# Altium project UPS_project.PrjPcb (part 3 of 4)
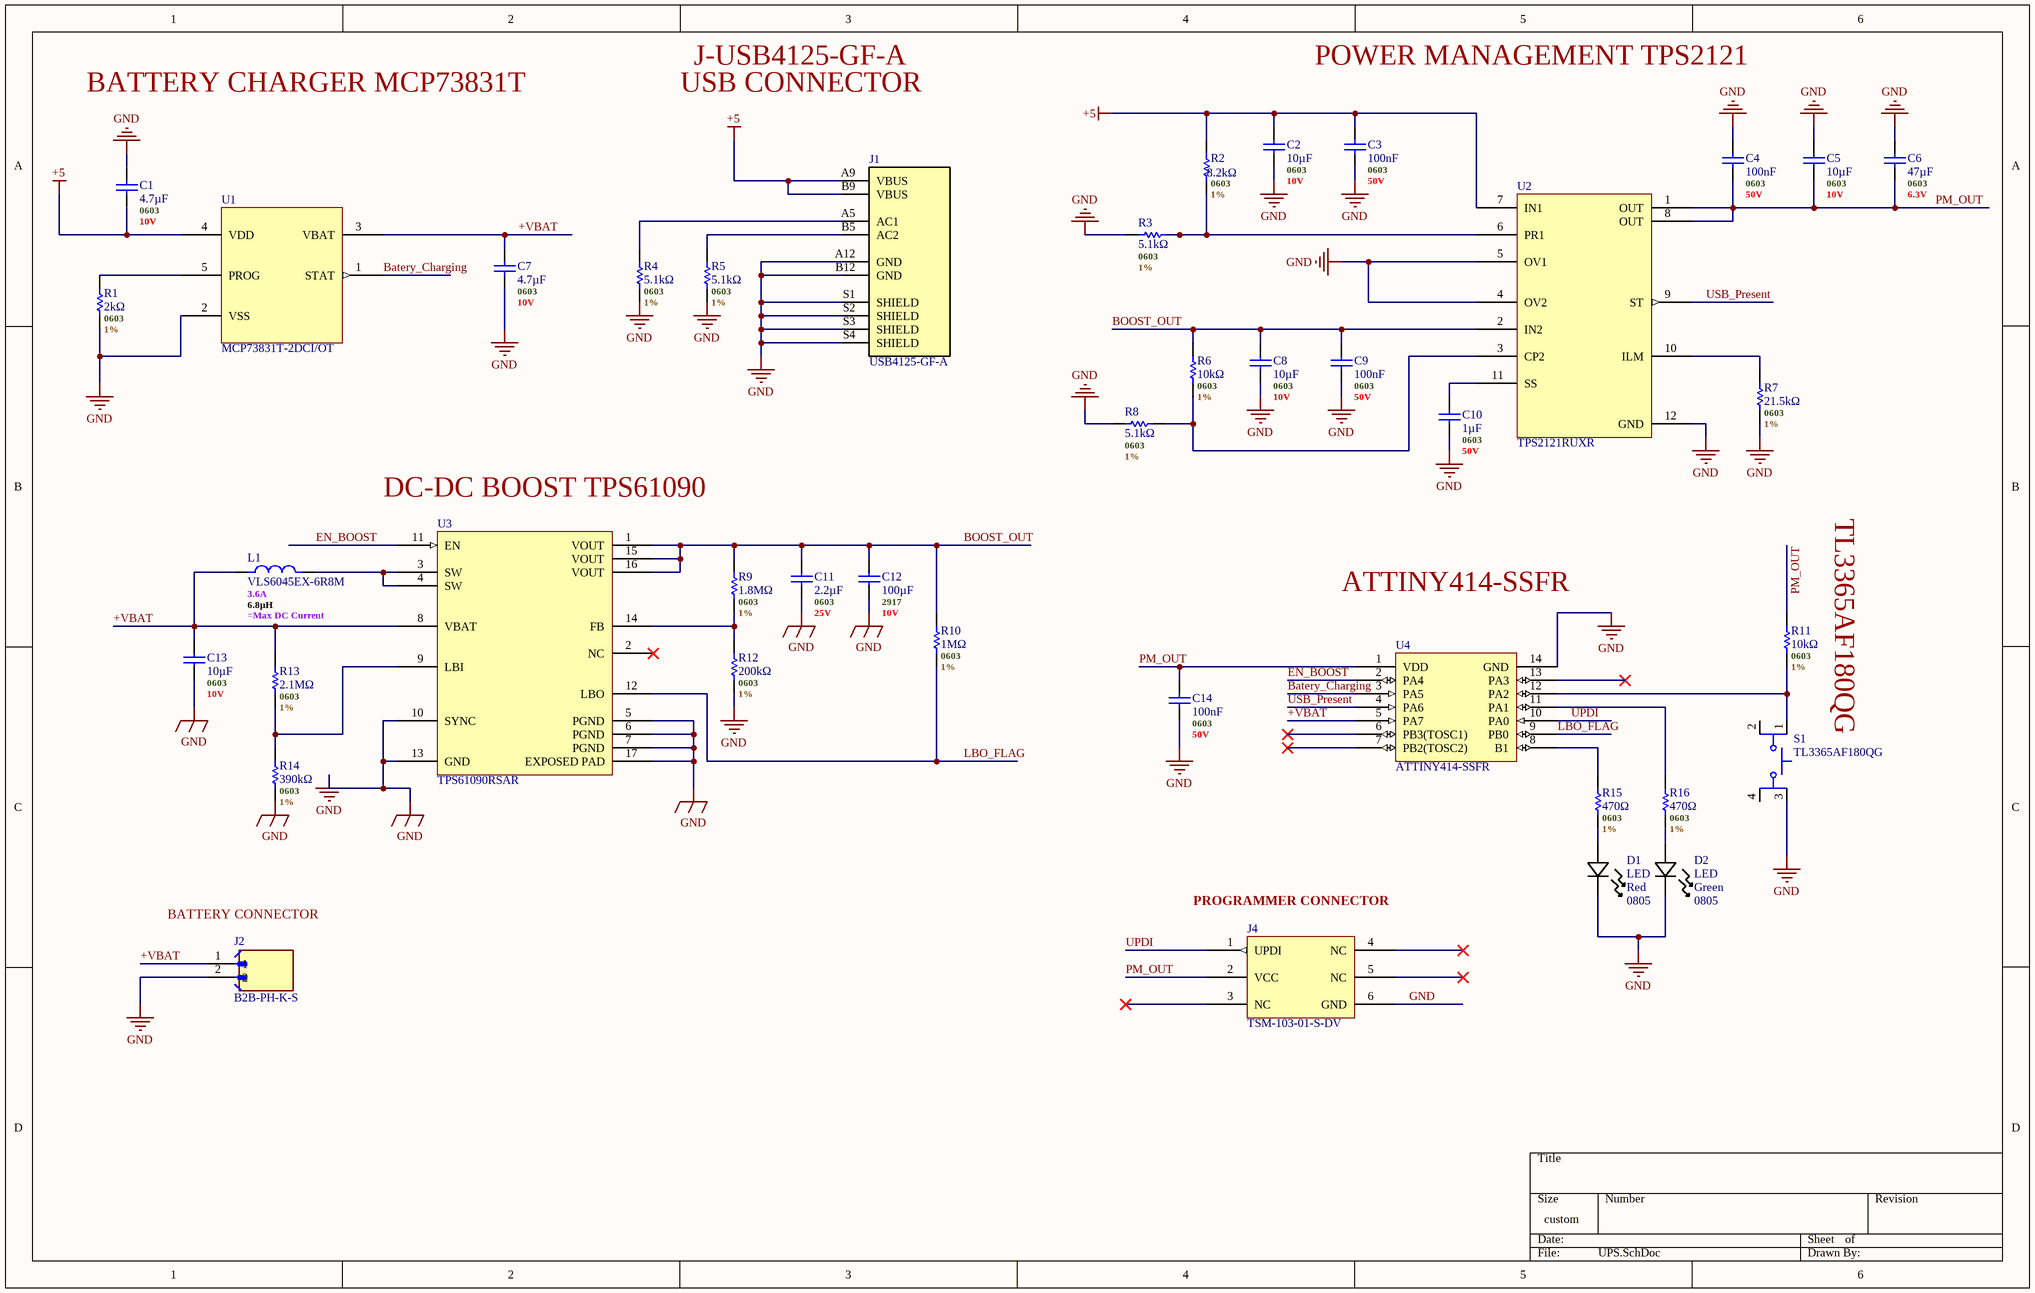
[diagram p2: UPS.SchDoc]

## Sheet UPS.SchDoc (continued)

### Library data of the parts (continued)
J4 = TSM-103-01-S-DV: Pin Header, Board-to-Board, 2.54 mm, 2 Rows, 6 Contacts, Surface Mount, TSM Series; Manufacturer: Samtec; Manufacturer Part Number: TSM-103-01-S-DV-P-TR; Manufacturer Lifecycle Status: PRODUCTION; Connector Type: Male Pin; Gender: Male; Max Current Rating: 7A; Max Voltage Rating (AC): 475V; Number of Contacts: 6; Pitch: 2.54mm; Supplier: DigiKey; Supplier Part Number: SAM13282TR-ND; RoHS: Compliant; Category: Headers and Wire Housings; Stock: 4800; Pricing: 150=1,1814, 750=0,8572, 1050=0,7779, 7500=0,6767, 15000=0,5197 (USD); Color: Black; Contact Material: Gold, Nickel; Contact Mating Length: 5.842mm; Contact Plating: Gold; Depth: 5.08mm; Height: 10.16mm; Housing Color: Black; Housing Material: Polymer; Lead Free: Lead Free; Length: 7.62mm; Lifecycle Status: Production; Max Operating Temperature: 125°C; Min Operating Temperature: -55°C; Mounting Technology: Surface Mount; Pins: 6; Number of Positions: 6; Number of Rows: 2; Packaging: Tape and Reel; Radiation Hardening: No; REACH SVHC: No; Row Spacing: 2.54mm; Termination: Solder; ComponentLink1URL: https://datasheet.octopart.com:443/TSM-103-01-S-DV-P-TR-Samtec-datasheet-151555687.pdf?src-supplier=Sager+Electronics; ComponentLink1Description: https://datasheet.octopart.com:443/TSM-103-01-S-DV-P-TR-Samtec-datasheet-151555687.pdf?src-supplier=Sager+Electronics; ComponentLink2URL: https://datasheet.octopart.com:443/TSM-103-01-S-DV-P-TR-Samtec-datasheet-97319594.pdf?src-supplier=Sager+Electronics; ComponentLink2Description: https://datasheet.octopart.com:443/TSM-103-01-S-DV-P-TR-Samtec-datasheet-97319594.pdf?src-supplier=Sager+Electronics; ComponentLink3URL: https://datasheet.octopart.com:443/TSM-103-01-S-DV-P-TR-Samtec-datasheet-155753699.pdf?src-supplier=Sager+Electronics; ComponentLink3Description: https://datasheet.octopart.com:443/TSM-103-01-S-DV-P-TR-Samtec-datasheet-155753699.pdf?src-supplier=Sager+Electronics; ComponentLink4URL: https://sigma.octopart.com:443/138897997/technical_drawing/Samtec-TSM-103-01-S-DV-P-TR.pdf?src-supplier=Upverter; ComponentLink4Description: https://sigma.octopart.com:443/138897997/technical_drawing/Samtec-TSM-103-01-S-DV-P-TR.pdf?src-supplier=Upverter; ComponentLink5URL: https://sigma.octopart.com:443/97319595/technical_drawing/Samtec-TSM-103-01-S-DV-P-TR.pdf?src-supplier=Samtec; ComponentLink5Description: https://sigma.octopart.com:443/97319595/technical_drawing/Samtec-TSM-103-01-S-DV-P-TR.pdf?src-supplier=Samtec; ComponentLink6URL: https://datasheet.octopart.com:443/TSM-103-01-S-DV-P-TR-Samtec-datasheet-68527555.pdf?src-supplier=Farnell; ComponentLink6Description: https://datasheet.octopart.com:443/TSM-103-01-S-DV-P-TR-Samtec-datasheet-68527555.pdf?src-supplier=Farnell; ComponentLink7URL: https://datasheet.octopart.com:443/TSM-103-01-S-DV-P-TR-Samtec-datasheet-141160580.pdf?src-supplier=Master+Electronics; ComponentLink7Description: https://datasheet.octopart.com:443/TSM-103-01-S-DV-P-TR-Samtec-datasheet-141160580.pdf?src-supplier=Master+Electronics; ComponentLink8URL: https://datasheet.octopart.com:443/TSM-103-01-S-DV-P-TR-Samtec-datasheet-41643181.pdf?src-supplier=Newark; ComponentLink8Description: https://datasheet.octopart.com:443/TSM-103-01-S-DV-P-TR-Samtec-datasheet-41643181.pdf?src-supplier=Newark; ComponentLink9URL: https://datasheet.octopart.com:443/TSM-103-01-S-DV-P-TR-Samtec-datasheet-24969259.pdf?src-supplier=Newark; ComponentLink9Description: https://datasheet.octopart.com:443/TSM-103-01-S-DV-P-TR-Samtec-datasheet-24969259.pdf?src-supplier=Newark; ComponentLink10URL: https://datasheet.octopart.com:443/TSM-103-01-S-DV-P-TR-Samtec-datasheet-180257387.pdf?src-supplier=JRH+Electronics; ComponentLink10Description: https://datasheet.octopart.com:443/TSM-103-01-S-DV-P-TR-Samtec-datasheet-180257387.pdf?src-supplier=JRH+Electronics; ComponentLink11URL: https://datasheet.octopart.com:443/TSM-103-01-S-DV-P-TR-Samtec-datasheet-116533474.pdf?src-supplier=Toby+Electronics; ComponentLink11Description: https://datasheet.octopart.com:443/TSM-103-01-S-DV-P-TR-Samtec-datasheet-116533474.pdf?src-supplier=Toby+Electronics; Supplier 1: DigiKey; Supplier Part Number 1: SAM13282CT-ND
L1 = INDUCTOR - GENERIC: Inductor Power Shielded Wirewound 6.8uH 20% 100KHz Ferrite 3.6A 0.0468Ohm DCR 2424 T/R; Manufacturer: TDK; Manufacturer Lifecycle Status: PRODUCTION; Current Rating: 4.7A; DC Resistance (DCR): 47mΩ; Value: 6.8µH; Number of Circuits: 1; Shielding: Yes; .Max DC Current: =Max DC Current; Supplier: DigiKey; Supplier Part Number: 445-173057-1-ND; Manufacturer Part Number: VLS6045EX-6R8M; RoHS: Compliant; Category: Fixed Inductors; Stock: 199761; Pricing: 1=0,34, 10=0,284, 100=0,2333 (USD); Case/Package: 2424; Composition: Wirewound; Core Material: Ferrite; Height: 4.5mm; Height - Seated (Max): 4.4958mm; Inductance Tolerance: 20%; Length: 6mm; Lifecycle Status: Production; Max Current Rating: 3.6A; Max Length: 6.3mm; Max Operating Temperature: 105°C; Max Width: 6.3mm; Min Length: 5.7mm; Min Operating Temperature: -40°C; Min Width: 5.7mm; Mounting Technology: Surface Mount; Number of Terminals: 2; REACH SVHC: Yes; RMS Current (Irms): 3.6A; Saturation Current: 4.7A; Schedule B: 8504500000, 8504500000|8504500000, 8504500000|8504500000|8504500000, 8504500000|8504500000|8504500000|8504500000; Test Frequency: 100kHz; Tolerance: 20%; Width: 6mm; ComponentLink1URL: https://datasheet.octopart.com:443/VLS6045EX-6R8M-TDK-datasheet-181269184.pdf?src-supplier=IHS; ComponentLink1Description: https://datasheet.octopart.com:443/VLS6045EX-6R8M-TDK-datasheet-181269184.pdf?src-supplier=IHS; ComponentLink2URL: https://datasheet.octopart.com:443/VLS6045EX-6R8M-TDK-datasheet-153842173.pdf?src-supplier=ODG+(Origin+Data+Global); ComponentLink2Description: https://datasheet.octopart.com:443/VLS6045EX-6R8M-TDK-datasheet-153842173.pdf?src-supplier=ODG+(Origin+Data+Global); ComponentLink3URL: https://datasheet.octopart.com:443/VLS6045EX-6R8M-TDK-datasheet-82987839.pdf?src-supplier=Newark; ComponentLink3Description: https://datasheet.octopart.com:443/VLS6045EX-6R8M-TDK-datasheet-82987839.pdf?src-supplier=Newark; ComponentLink4URL: https://datasheet.octopart.com:443/VLS6045EX-6R8M-TDK-datasheet-41475571.pdf?src-supplier=Newark; ComponentLink4Description: https://datasheet.octopart.com:443/VLS6045EX-6R8M-TDK-datasheet-41475571.pdf?src-supplier=Newark; ComponentLink5URL: https://datasheet.octopart.com:443/VLS6045EX-6R8M-TDK-datasheet-60278255.pdf?src-supplier=Future+Electronics; ComponentLink5Description: https://datasheet.octopart.com:443/VLS6045EX-6R8M-TDK-datasheet-60278255.pdf?src-supplier=Future+Electronics; Supplier 1: DigiKey; Supplier Part Number 1: 445-173057-1-ND
R1 = RESISTOR - GENERIC: Res Thick Film 0603 2K Ohm 1% 0.1W(1/10W) ±100ppm/C Epoxy Pad SMD Automotive T/R; Manufacturer: Yageo Group; Manufacturer Part Number: AC0603FR-102KL; Power Dissipation: 100mW; Temperature Coefficient: 100ppm/°C; Voltage Rating: 75V; Supplier: DigiKey; Supplier Part Number: 13-AC0603FR-102KLCT-ND; RoHS: Compliant; Category: Chip SMD Resistors; Stock: 20182; Pricing: 1=0,1, 10=0,007, 25=0,006, 50=0,0052, 100=0,005 (USD); Case/Package: 0603; China RoHS: Non-Compliant; Composition: Thick Film; Height: 450µm; Lifecycle Status: Production; Max Operating Temperature: 155°C; Min Operating Temperature: -55°C; Mounting Technology: Surface Mount; Number of Terminals: 2; Packaging: Tape & Reel; Power Rating: 100mW; REACH SVHC: Yes; Value: 2kΩ; Tolerance: 1%; Width: 800µm; Working Voltage: 75V; ComponentLink1URL: https://datasheet.octopart.com:443/AC0603FR-102KL-Yageo-datasheet-182189377.pdf?src-supplier=IHS; ComponentLink1Description: https://datasheet.octopart.com:443/AC0603FR-102KL-Yageo-datasheet-182189377.pdf?src-supplier=IHS; ComponentLink2URL: https://datasheet.octopart.com:443/AC0603FR-102KL-Yageo-datasheet-151884373.pdf?src-supplier=Upverter; ComponentLink2Description: https://datasheet.octopart.com:443/AC0603FR-102KL-Yageo-datasheet-151884373.pdf?src-supplier=Upverter; ComponentLink3URL: https://sigma.octopart.com:443/138820526/technical_drawing/Yageo-AC0603FR-102KL.pdf?src-supplier=Upverter; ComponentLink3Description: https://sigma.octopart.com:443/138820526/technical_drawing/Yageo-AC0603FR-102KL.pdf?src-supplier=Upverter; ComponentLink4URL: https://datasheet.octopart.com:443/AC0603FR-102KL-Yageo-datasheet-86786639.pdf?src-supplier=Upverter; ComponentLink4Description: https://datasheet.octopart.com:443/AC0603FR-102KL-Yageo-datasheet-86786639.pdf?src-supplier=Upverter; ComponentLink5URL: https://datasheet.octopart.com:443/AC0603FR-102KL-Yageo-datasheet-178509465.pdf?src-supplier=Farnell; ComponentLink5Description: https://datasheet.octopart.com:443/AC0603FR-102KL-Yageo-datasheet-178509465.pdf?src-supplier=Farnell; ComponentLink6URL: https://datasheet.octopart.com:443/AC0603FR-102KL-Yageo-datasheet-166720450.pdf?src-supplier=JRH+Electronics; ComponentLink6Description: https://datasheet.octopart.com:443/AC0603FR-102KL-Yageo-datasheet-166720450.pdf?src-supplier=JRH+Electronics; ComponentLink7URL: https://datasheet.octopart.com:443/AC0603FR-102KL-Yageo-datasheet-137699919.pdf?src-supplier=Future+Electronics; ComponentLink7Description: https://datasheet.octopart.com:443/AC0603FR-102KL-Yageo-datasheet-137699919.pdf?src-supplier=Future+Electronics; ComponentLink8URL: https://datasheet.octopart.com/AC0603FR-102KL-Yageo-datasheet-12512238.pdf; ComponentLink8Description: https://datasheet.octopart.com/AC0603FR-102KL-Yageo-datasheet-12512238.pdf; ComponentLink9URL: http://sigma.octopart.com:80/rohs_statement/Yageo-company-2.pdf?src-supplier=Compliance+Statements; ComponentLink9Description: http://sigma.octopart.com:80/rohs_statement/Yageo-company-2.pdf?src-supplier=Compliance+Statements; ComponentLink10URL: http://sigma.octopart.com:80/conflict_mineral_statement/Yageo-company-3.pdf?src-supplier=Compliance+Statements; ComponentLink10Description: http://sigma.octopart.com:80/conflict_mineral_statement/Yageo-company-3.pdf?src-supplier=Compliance+Statements; Supplier 1: DigiKey; Supplier Part Number 1: 13-AC0603FR-102KLCT-ND
R2 = RESISTOR - GENERIC: Res Thick Film 0603 8.2K Ohm 1% 0.1W(1/10W) ±100ppm/C Pad SMD T/R; Manufacturer: Yageo Group; Manufacturer Part Number: RC0603FR-138K2L; Power Dissipation: 100mW; Temperature Coefficient: 100ppm/°C; Voltage Rating: 50V; Working Voltage: 75V; Supplier: DigiKey; Supplier Part Number: 13-RC0603FR-138K2LCT-ND; RoHS: Compliant; Category: Chip SMD Resistors; Stock: 30843; Pricing: 1=0,1, 10=0,008, 25=0,0072, 50=0,0062, 100=0,0051, 250=0,004 (USD); Case/Package: 0603; Case Code (Imperial): 0603; Case Code (Metric): 1608; China RoHS: Non-Compliant; Composition: Thick Film; Depth: 800µm; Height: 450µm; Length: 1.6mm; Lifecycle Status: Production; Max Operating Temperature: 155°C; Military Standard: Not; Min Operating Temperature: -55°C; Mounting Technology: Surface Mount; Number of Terminals: 2; Power Rating: 100mW; REACH SVHC: Yes; Value: 8.2kΩ; Schedule B: 8533210045, 8533210045|8533210045, 8533210045|8533210045|8533210045, 8533210045|8533210045|8533210045|8533210045; Termination: SMD/SMT; Tolerance: 1%; Width: 800µm; ComponentLink1URL: https://datasheet.octopart.com:443/RC0603FR-138K2L-Yageo-datasheet-175887523.pdf?src-supplier=Newark; ComponentLink1Description: https://datasheet.octopart.com:443/RC0603FR-138K2L-Yageo-datasheet-175887523.pdf?src-supplier=Newark; ComponentLink2URL: https://datasheet.octopart.com:443/RC0603FR-138K2L-Yageo-datasheet-164759695.pdf?src-supplier=Future+Electronics; ComponentLink2Description: https://datasheet.octopart.com:443/RC0603FR-138K2L-Yageo-datasheet-164759695.pdf?src-supplier=Future+Electronics; ComponentLink3URL: https://datasheet.octopart.com/RC0603FR-138K2L-Yageo-datasheet-73766026.pdf; ComponentLink3Description: https://datasheet.octopart.com/RC0603FR-138K2L-Yageo-datasheet-73766026.pdf; ComponentLink4URL: http://sigma.octopart.com:80/rohs_statement/Yageo-company-2.pdf?src-supplier=Compliance+Statements; ComponentLink4Description: http://sigma.octopart.com:80/rohs_statement/Yageo-company-2.pdf?src-supplier=Compliance+Statements; ComponentLink5URL: http://sigma.octopart.com:80/conflict_mineral_statement/Yageo-company-3.pdf?src-supplier=Compliance+Statements; ComponentLink5Description: http://sigma.octopart.com:80/conflict_mineral_statement/Yageo-company-3.pdf?src-supplier=Compliance+Statements; Supplier 1: DigiKey; Supplier Part Number 1: 13-RC0603FR-138K2LCT-ND
R3-R5 R8 = RESISTOR - GENERIC: Res Thick Film 0603 5.1K Ohm 1% 0.1W(1/10W) ±100ppm/C Pad SMD T/R; Manufacturer: Yageo Group; Manufacturer Part Number: RC0603FR-075K1L; Max Power Dissipation: 100mW; Temperature Coefficient: 100ppm/°C; Voltage Rating: 75V; Voltage Rating (DC): 50V; Supplier: DigiKey; Supplier Part Number: 311-5.10KHRCT-ND; RoHS: Compliant; Category: Chip SMD Resistors; Stock: 734211; Pricing: 1=0,1, 10=0,007, 25=0,0068, 50=0,0062, 100=0,0056 (USD); Case/Package: 0603; Case Code (Imperial): 0603; China RoHS: Non-Compliant; Composition: Thick Film; Depth: 800µm; Features: Moisture Resistant; Height: 450µm; Lead Free: Lead Free; Lifecycle Status: Production; Max Operating Temperature: 155°C; Military Standard: Not; Min Operating Temperature: -55°C; Mounting Technology: Surface Mount; Pins: 2; Number of Terminals: 2; Number of Terminations: 2; Packaging: Tape & Reel; Power Dissipation: 100mW; Power Rating: 100mW; REACH SVHC: Yes; Value: 5.1kΩ; Schedule B: 8533210045, 8533210045|8533210045, 8533210045|8533210045|8533210045, 8533210045|8533210045|8533210045|8533210045; Termination: SMD/SMT; Tolerance: 1%; Width: 800µm; Working Voltage: 75V; ComponentLink1URL: https://datasheet.octopart.com:443/RC0603FR-075K1L-Yageo-datasheet-175887523.pdf?src-supplier=IHS; ComponentLink1Description: https://datasheet.octopart.com:443/RC0603FR-075K1L-Yageo-datasheet-175887523.pdf?src-supplier=IHS; ComponentLink2URL: https://datasheet.octopart.com:443/RC0603FR-075K1L-Yageo-datasheet-103092701.pdf?src-supplier=Upverter; ComponentLink2Description: https://datasheet.octopart.com:443/RC0603FR-075K1L-Yageo-datasheet-103092701.pdf?src-supplier=Upverter; ComponentLink3URL: https://datasheet.octopart.com:443/RC0603FR-075K1L-Yageo-datasheet-8328172.pdf?src-supplier=Farnell; ComponentLink3Description: https://datasheet.octopart.com:443/RC0603FR-075K1L-Yageo-datasheet-8328172.pdf?src-supplier=Farnell; ComponentLink4URL: https://datasheet.octopart.com:443/RC0603FR-075K1L-Yageo-datasheet-62067350.pdf?src-supplier=Farnell; ComponentLink4Description: https://datasheet.octopart.com:443/RC0603FR-075K1L-Yageo-datasheet-62067350.pdf?src-supplier=Farnell; ComponentLink5URL: https://datasheet.octopart.com:443/RC0603FR-075K1L-Yageo-datasheet-34211833.pdf?src-supplier=element14+APAC; ComponentLink5Description: https://datasheet.octopart.com:443/RC0603FR-075K1L-Yageo-datasheet-34211833.pdf?src-supplier=element14+APAC; ComponentLink6URL: https://datasheet.octopart.com:443/RC0603FR-075K1L-Yageo-datasheet-164759695.pdf?src-supplier=Future+Electronics; ComponentLink6Description: https://datasheet.octopart.com:443/RC0603FR-075K1L-Yageo-datasheet-164759695.pdf?src-supplier=Future+Electronics; ComponentLink7URL: https://datasheet.octopart.com:443/RC0603FR-075K1L-Yageo-datasheet-137700087.pdf?src-supplier=Future+Electronics; ComponentLink7Description: https://datasheet.octopart.com:443/RC0603FR-075K1L-Yageo-datasheet-137700087.pdf?src-supplier=Future+Electronics; ComponentLink8URL: https://datasheet.octopart.com:443/RC0603FR-075K1L-Yageo-datasheet-15599030.pdf?src-supplier=Future+Electronics; ComponentLink8Description: https://datasheet.octopart.com:443/RC0603FR-075K1L-Yageo-datasheet-15599030.pdf?src-supplier=Future+Electronics; ComponentLink9URL: https://datasheet.octopart.com:443/RC0603FR-075K1L-Yageo-datasheet-12596169.pdf?src-supplier=Future+Electronics; ComponentLink9Description: https://datasheet.octopart.com:443/RC0603FR-075K1L-Yageo-datasheet-12596169.pdf?src-supplier=Future+Electronics; ComponentLink10URL: https://datasheet.octopart.com:443/RC0603FR-075K1L-Yageo-datasheet-503470.pdf?src-supplier=Future+Electronics; ComponentLink10Description: https://datasheet.octopart.com:443/RC0603FR-075K1L-Yageo-datasheet-503470.pdf?src-supplier=Future+Electronics; ComponentLink11URL: https://datasheet.octopart.com:443/RC0603FR-075K1L-Yageo-datasheet-148775077.pdf?src-supplier=TME; ComponentLink11Description: https://datasheet.octopart.com:443/RC0603FR-075K1L-Yageo-datasheet-148775077.pdf?src-supplier=TME; ComponentLink12URL: https://datasheet.octopart.com:443/RC0603FR-075K1L-Yageo-datasheet-79472498.pdf?src-supplier=Megastar; ComponentLink12Description: https://datasheet.octopart.com:443/RC0603FR-075K1L-Yageo-datasheet-79472498.pdf?src-supplier=Megastar; ComponentLink13URL: https://datasheet.octopart.com/RC0603FR-075K1L-Yageo-datasheet-73766026.pdf; ComponentLink13Description: https://datasheet.octopart.com/RC0603FR-075K1L-Yageo-datasheet-73766026.pdf; ComponentLink14URL: https://datasheet.octopart.com:443/RC0603FR-075K1L-Yageo-datasheet-118562.pdf?src-supplier=DigiKey; ComponentLink14Description: https://datasheet.octopart.com:443/RC0603FR-075K1L-Yageo-datasheet-118562.pdf?src-supplier=DigiKey; ComponentLink15URL: http://sigma.octopart.com:80/conflict_mineral_statement/Yageo-company-3.pdf?src-supplier=Compliance+Statements; ComponentLink15Description: http://sigma.octopart.com:80/conflict_mineral_statement/Yageo-company-3.pdf?src-supplier=Compliance+Statements; ComponentLink16URL: http://sigma.octopart.com:80/rohs_statement/Yageo-company-2.pdf?src-supplier=Compliance+Statements; ComponentLink16Description: http://sigma.octopart.com:80/rohs_statement/Yageo-company-2.pdf?src-supplier=Compliance+Statements; Supplier 1: DigiKey; Supplier Part Number 1: 311-5.10KHRCT-ND
R6 R11 = RESISTOR - GENERIC: 100mW Thick Film Resistors ±100ppm/℃ ±1% 10kΩ 0603 Chip Resistor - Surface Mount ROHS; Manufacturer: Yageo Group; Manufacturer Part Number: RC0603FR-0710KL; Temperature Coefficient: 100ppm/°C; Voltage Rating: 75V; Voltage Rating (DC): 50V; Supplier: DigiKey; Supplier Part Number: 311-10.0KHRCT-ND; RoHS: Compliant; Category: Chip SMD Resistors; Stock: 13219476; Pricing: 1=0,1, 10=0,006, 25=0,0052 (USD); Case/Package: 0603; Case Code (Imperial): 0603; Case Code (Metric): 0603; China RoHS: Non-Compliant; Composition: Thick Film; Depth: 800µm; Height: 450µm; Lead Free: Lead Free; Lead Pitch: 300µm; Length: 1.6mm; Lifecycle Status: Production; Max Operating Temperature: 155°C; Military Standard: Not; Min Operating Temperature: -55°C; Mounting Technology: Surface Mount; Pins: 2; Number of Terminals: 2; Packaging: Tape & Reel; Power Dissipation: 100mW; Power Rating: 100mW; REACH SVHC: Yes; Value: 10kΩ; Schedule B: 8533210045, 8533210045|8533210045|8533210045|8533210045|8533210045|8533210045|8533210045|8533210045|8533210045|8533210045|8533210045|8533210045|8533210045|8533210045|8533210045|8533210045|8533210045|8533210045|8533210045|8533210045|8533210045|8533210045|8533210045|85; Termination: SMD/SMT; Tolerance: 1%; Weight: 2.012816mg; Width: 800µm; Working Voltage: 75V; ComponentLink1URL: https://datasheet.octopart.com:443/RC0603FR-0710KL-Yageo-datasheet-175887523.pdf?src-supplier=IHS; ComponentLink1Description: https://datasheet.octopart.com:443/RC0603FR-0710KL-Yageo-datasheet-175887523.pdf?src-supplier=IHS; ComponentLink2URL: https://datasheet.octopart.com:443/RC0603FR-0710KL-Yageo-datasheet-103092701.pdf?src-supplier=Upverter; ComponentLink2Description: https://datasheet.octopart.com:443/RC0603FR-0710KL-Yageo-datasheet-103092701.pdf?src-supplier=Upverter; ComponentLink3URL: https://datasheet.octopart.com:443/RC0603FR-0710KL-Yageo-datasheet-98239111.pdf?src-supplier=Upverter; ComponentLink3Description: https://datasheet.octopart.com:443/RC0603FR-0710KL-Yageo-datasheet-98239111.pdf?src-supplier=Upverter; ComponentLink4URL: https://datasheet.octopart.com:443/RC0603FR-0710KL-Yageo-datasheet-141265859.pdf?src-supplier=Upverter; ComponentLink4Description: https://datasheet.octopart.com:443/RC0603FR-0710KL-Yageo-datasheet-141265859.pdf?src-supplier=Upverter; ComponentLink5URL: https://sigma.octopart.com:443/138820526/technical_drawing/Yageo-RC0603FR-0710KL.pdf?src-supplier=Upverter; ComponentLink5Description: https://sigma.octopart.com:443/138820526/technical_drawing/Yageo-RC0603FR-0710KL.pdf?src-supplier=Upverter; ComponentLink6URL: https://datasheet.octopart.com:443/RC0603FR-0710KL-Yageo-datasheet-8328172.pdf?src-supplier=Farnell; ComponentLink6Description: https://datasheet.octopart.com:443/RC0603FR-0710KL-Yageo-datasheet-8328172.pdf?src-supplier=Farnell; ComponentLink7URL: https://datasheet.octopart.com:443/RC0603FR-0710KL-Yageo-datasheet-13691069.pdf?src-supplier=Farnell; ComponentLink7Description: https://datasheet.octopart.com:443/RC0603FR-0710KL-Yageo-datasheet-13691069.pdf?src-supplier=Farnell; ComponentLink8URL: https://datasheet.octopart.com:443/RC0603FR-0710KL-Yageo-datasheet-62067350.pdf?src-supplier=element14+APAC; ComponentLink8Description: https://datasheet.octopart.com:443/RC0603FR-0710KL-Yageo-datasheet-62067350.pdf?src-supplier=element14+APAC; ComponentLink9URL: https://datasheet.octopart.com:443/RC0603FR-0710KL-Yageo-datasheet-17842380.pdf?src-supplier=element14+APAC; ComponentLink9Description: https://datasheet.octopart.com:443/RC0603FR-0710KL-Yageo-datasheet-17842380.pdf?src-supplier=element14+APAC; ComponentLink10URL: https://datasheet.octopart.com:443/RC0603FR-0710KL-Yageo-datasheet-15599030.pdf?src-supplier=Future+Electronics; ComponentLink10Description: https://datasheet.octopart.com:443/RC0603FR-0710KL-Yageo-datasheet-15599030.pdf?src-supplier=Future+Electronics; ComponentLink11URL: https://datasheet.octopart.com:443/RC0603FR-0710KL-Yageo-datasheet-164759695.pdf?src-supplier=Future+Electronics; ComponentLink11Description: https://datasheet.octopart.com:443/RC0603FR-0710KL-Yageo-datasheet-164759695.pdf?src-supplier=Future+Electronics; ComponentLink12URL: https://datasheet.octopart.com:443/RC0603FR-0710KL-Yageo-datasheet-127823281.pdf?src-supplier=Future+Electronics; ComponentLink12Description: https://datasheet.octopart.com:443/RC0603FR-0710KL-Yageo-datasheet-127823281.pdf?src-supplier=Future+Electronics; ComponentLink13URL: https://datasheet.octopart.com:443/RC0603FR-0710KL-Yageo-datasheet-137700087.pdf?src-supplier=Future+Electronics; ComponentLink13Description: https://datasheet.octopart.com:443/RC0603FR-0710KL-Yageo-datasheet-137700087.pdf?src-supplier=Future+Electronics; ComponentLink14URL: https://datasheet.octopart.com:443/RC0603FR-0710KL-Yageo-datasheet-27584510.pdf?src-supplier=Future+Electronics; ComponentLink14Description: https://datasheet.octopart.com:443/RC0603FR-0710KL-Yageo-datasheet-27584510.pdf?src-supplier=Future+Electronics; ComponentLink15URL: https://datasheet.octopart.com:443/RC0603FR-0710KL-Yageo-datasheet-8324193.pdf?src-supplier=Future+Electronics; ComponentLink15Description: https://datasheet.octopart.com:443/RC0603FR-0710KL-Yageo-datasheet-8324193.pdf?src-supplier=Future+Electronics; ComponentLink16URL: https://datasheet.octopart.com:443/RC0603FR-0710KL-Yageo-datasheet-12596169.pdf?src-supplier=Newark; ComponentLink16Description: https://datasheet.octopart.com:443/RC0603FR-0710KL-Yageo-datasheet-12596169.pdf?src-supplier=Newark; ComponentLink17URL: https://datasheet.octopart.com:443/RC0603FR-0710KL-Yageo-datasheet-503470.pdf?src-supplier=Newark; ComponentLink17Description: https://datasheet.octopart.com:443/RC0603FR-0710KL-Yageo-datasheet-503470.pdf?src-supplier=Newark; ComponentLink18URL: https://datasheet.octopart.com:443/RC0603FR-0710KL-Yageo-datasheet-34211833.pdf?src-supplier=Newark; ComponentLink18Description: https://datasheet.octopart.com:443/RC0603FR-0710KL-Yageo-datasheet-34211833.pdf?src-supplier=Newark; ComponentLink19URL: https://datasheet.octopart.com:443/RC0603FR-0710KL-Yageo-datasheet-79472498.pdf?src-supplier=Megastar; ComponentLink19Description: https://datasheet.octopart.com:443/RC0603FR-0710KL-Yageo-datasheet-79472498.pdf?src-supplier=Megastar; ComponentLink20URL: https://datasheet.octopart.com/RC0603FR-0710KL-Yageo-datasheet-73766026.pdf; ComponentLink20Description: https://datasheet.octopart.com/RC0603FR-0710KL-Yageo-datasheet-73766026.pdf; ComponentLink21URL: https://datasheet.octopart.com:443/RC0603FR-0710KL-Yageo-datasheet-118562.pdf?src-supplier=DigiKey; ComponentLink21Description: https://datasheet.octopart.com:443/RC0603FR-0710KL-Yageo-datasheet-118562.pdf?src-supplier=DigiKey; ComponentLink22URL: http://sigma.octopart.com:80/conflict_mineral_statement/Yageo-company-3.pdf?src-supplier=Compliance+Statements; ComponentLink22Description: http://sigma.octopart.com:80/conflict_mineral_statement/Yageo-company-3.pdf?src-supplier=Compliance+Statements; ComponentLink23URL: http://sigma.octopart.com:80/rohs_statement/Yageo-company-2.pdf?src-supplier=Compliance+Statements; ComponentLink23Description: http://sigma.octopart.com:80/rohs_statement/Yageo-company-2.pdf?src-supplier=Compliance+Statements; Supplier 1: DigiKey; Supplier Part Number 1: 311-10.0KHRCT-ND
R7 = RESISTOR - GENERIC: Res Thick Film 0603 21.5K Ohm 1% 0.1W(1/10W) ±100ppm/C Pad SMD T/R; Manufacturer: Yageo Group; Manufacturer Part Number: RC0603FR-0721K5L; Max Power Dissipation: 100mW; Temperature Coefficient: 100ppm/°C; Voltage Rating: 75V; Voltage Rating (DC): 50V; Supplier: Mouser; Supplier Part Number: 603-RC0603FR-0721K5L; RoHS: Compliant; Category: Chip SMD Resistors; Stock: 1866808; Pricing: 1=0,1, 10=0,006, 50=0,006, 100=0,006, 1000=0,006, 10000=0,002 (USD); Case/Package: 0603; Case Code (Imperial): 0603; China RoHS: Non-Compliant; Composition: Thick Film; Depth: 800µm; Features: Moisture Resistant; Height: 450µm; Lead Free: Lead Free; Length: 1.6mm; Lifecycle Status: Production; Max Operating Temperature: 155°C; Military Standard: Not; Min Operating Temperature: -55°C; Mounting Technology: Surface Mount; Number of Terminals: 2; Number of Terminations: 2; Power Dissipation: 100mW; Power Rating: 100mW; REACH SVHC: Yes; Value: 21.5kΩ; Schedule B: 8533210045, 8533210045|8533210045, 8533210045|8533210045|8533210045, 8533210045|8533210045|8533210045|8533210045; Termination: SMD/SMT; Tolerance: 1%; Width: 800µm; Working Voltage: 75V; ComponentLink1URL: https://datasheet.octopart.com:443/RC0603FR-0721K5L-Yageo-datasheet-175887523.pdf?src-supplier=Newark; ComponentLink1Description: https://datasheet.octopart.com:443/RC0603FR-0721K5L-Yageo-datasheet-175887523.pdf?src-supplier=Newark; ComponentLink2URL: https://datasheet.octopart.com:443/RC0603FR-0721K5L-Yageo-datasheet-103092701.pdf?src-supplier=Upverter; ComponentLink2Description: https://datasheet.octopart.com:443/RC0603FR-0721K5L-Yageo-datasheet-103092701.pdf?src-supplier=Upverter; ComponentLink3URL: https://datasheet.octopart.com:443/RC0603FR-0721K5L-Yageo-Group-datasheet-189192902.pdf?src-supplier=TME; ComponentLink3Description: https://datasheet.octopart.com:443/RC0603FR-0721K5L-Yageo-Group-datasheet-189192902.pdf?src-supplier=TME; ComponentLink4URL: https://datasheet.octopart.com:443/RC0603FR-0721K5L-Yageo-Group-datasheet-176638170.pdf?src-supplier=TME; ComponentLink4Description: https://datasheet.octopart.com:443/RC0603FR-0721K5L-Yageo-Group-datasheet-176638170.pdf?src-supplier=TME; ComponentLink5URL: https://datasheet.octopart.com:443/RC0603FR-0721K5L-Yageo-datasheet-164759695.pdf?src-supplier=Future+Electronics; ComponentLink5Description: https://datasheet.octopart.com:443/RC0603FR-0721K5L-Yageo-datasheet-164759695.pdf?src-supplier=Future+Electronics; ComponentLink6URL: https://datasheet.octopart.com:443/RC0603FR-0721K5L-Yageo-datasheet-137700087.pdf?src-supplier=Future+Electronics; ComponentLink6Description: https://datasheet.octopart.com:443/RC0603FR-0721K5L-Yageo-datasheet-137700087.pdf?src-supplier=Future+Electronics; ComponentLink7URL: https://datasheet.octopart.com:443/RC0603FR-0721K5L-Yageo-datasheet-15599030.pdf?src-supplier=Future+Electronics; ComponentLink7Description: https://datasheet.octopart.com:443/RC0603FR-0721K5L-Yageo-datasheet-15599030.pdf?src-supplier=Future+Electronics; ComponentLink8URL: https://datasheet.octopart.com:443/RC0603FR-0721K5L-Yageo-datasheet-12596169.pdf?src-supplier=Future+Electronics; ComponentLink8Description: https://datasheet.octopart.com:443/RC0603FR-0721K5L-Yageo-datasheet-12596169.pdf?src-supplier=Future+Electronics; ComponentLink9URL: https://datasheet.octopart.com:443/RC0603FR-0721K5L-Yageo-datasheet-8328172.pdf?src-supplier=Future+Electronics; ComponentLink9Description: https://datasheet.octopart.com:443/RC0603FR-0721K5L-Yageo-datasheet-8328172.pdf?src-supplier=Future+Electronics; ComponentLink10URL: https://datasheet.octopart.com/RC0603FR-0721K5L-Yageo-datasheet-73766026.pdf; ComponentLink10Description: https://datasheet.octopart.com/RC0603FR-0721K5L-Yageo-datasheet-73766026.pdf; ComponentLink11URL: https://datasheet.octopart.com:443/RC0603FR-0721K5L-Yageo-datasheet-118562.pdf?src-supplier=DigiKey; ComponentLink11Description: https://datasheet.octopart.com:443/RC0603FR-0721K5L-Yageo-datasheet-118562.pdf?src-supplier=DigiKey; ComponentLink12URL: http://sigma.octopart.com:80/conflict_mineral_statement/Yageo-company-3.pdf?src-supplier=Compliance+Statements; ComponentLink12Description: http://sigma.octopart.com:80/conflict_mineral_statement/Yageo-company-3.pdf?src-supplier=Compliance+Statements; ComponentLink13URL: http://sigma.octopart.com:80/rohs_statement/Yageo-company-2.pdf?src-supplier=Compliance+Statements; ComponentLink13Description: http://sigma.octopart.com:80/rohs_statement/Yageo-company-2.pdf?src-supplier=Compliance+Statements; Supplier 1: Mouser; Supplier Part Number 1: 603-RC0603FR-0721K5L
R9 = RESISTOR - GENERIC: Res Thick Film 0603 1.8M Ohm 1% 0.1W(1/10W) +/-100ppm/ﾟC Epoxy SMD T/R; Manufacturer: Yageo Group; Manufacturer Part Number: RC0603FR-071M8L; Max Power Dissipation: 100mW; Temperature Coefficient: 100ppm/°C; Voltage Rating: 75V; Voltage Rating (AC): 50V; Supplier: DigiKey; Supplier Part Number: YAG3328CT-ND; RoHS: Compliant; Category: Chip SMD Resistors; Stock: 2687; Pricing: 1=0,1, 10=0,011, 25=0,0092, 50=0,0072, 100=0,0068, 250=0,00568 (USD); Case/Package: 0603; Case Code (Imperial): 0603; Case Code (Metric): 1608; China RoHS: Non-Compliant; Composition: Thick Film; Depth: 800µm; Features: Moisture Resistant; Height: 450µm; Lead Free: Lead Free; Length: 1.6mm; Lifecycle Status: Production; Max Operating Temperature: 155°C; Military Standard: Not; Min Operating Temperature: -55°C; Mounting Technology: Surface Mount; Pins: 2; Number of Terminals: 2; Number of Terminations: 2; Packaging: Cut Tape; Power Dissipation: 100mW; Power Rating: 100mW; REACH SVHC: Yes; Value: 1.8MΩ; Schedule B: 8533210045, 8533210045|8533210045|8533210045|8533210045|8533210045; Termination: SMD/SMT; Tolerance: 1%; Voltage Rating (DC): 50V; Width: 800µm; Working Voltage: 75V; ComponentLink1URL: https://datasheet.octopart.com:443/RC0603FR-071M8L-Yageo-datasheet-175887523.pdf?src-supplier=Newark; ComponentLink1Description: https://datasheet.octopart.com:443/RC0603FR-071M8L-Yageo-datasheet-175887523.pdf?src-supplier=Newark; ComponentLink2URL: https://datasheet.octopart.com:443/RC0603FR-071M8L-Yageo-datasheet-103092701.pdf?src-supplier=Upverter; ComponentLink2Description: https://datasheet.octopart.com:443/RC0603FR-071M8L-Yageo-datasheet-103092701.pdf?src-supplier=Upverter; ComponentLink3URL: https://datasheet.octopart.com:443/RC0603FR-071M8L-Yageo-datasheet-8328172.pdf?src-supplier=element14+APAC; ComponentLink3Description: https://datasheet.octopart.com:443/RC0603FR-071M8L-Yageo-datasheet-8328172.pdf?src-supplier=element14+APAC; ComponentLink4URL: https://datasheet.octopart.com:443/RC0603FR-071M8L-Yageo-datasheet-62067350.pdf?src-supplier=Farnell; ComponentLink4Description: https://datasheet.octopart.com:443/RC0603FR-071M8L-Yageo-datasheet-62067350.pdf?src-supplier=Farnell; ComponentLink5URL: https://datasheet.octopart.com:443/RC0603FR-071M8L-Yageo---Phycomp-datasheet-34211833.pdf?src-supplier=Farnell; ComponentLink5Description: https://datasheet.octopart.com:443/RC0603FR-071M8L-Yageo---Phycomp-datasheet-34211833.pdf?src-supplier=Farnell; ComponentLink6URL: https://datasheet.octopart.com:443/RC0603FR-071M8L-Yageo-datasheet-164759695.pdf?src-supplier=Future+Electronics; ComponentLink6Description: https://datasheet.octopart.com:443/RC0603FR-071M8L-Yageo-datasheet-164759695.pdf?src-supplier=Future+Electronics; ComponentLink7URL: https://datasheet.octopart.com:443/RC0603FR-071M8L-Yageo-datasheet-137700087.pdf?src-supplier=Future+Electronics; ComponentLink7Description: https://datasheet.octopart.com:443/RC0603FR-071M8L-Yageo-datasheet-137700087.pdf?src-supplier=Future+Electronics; ComponentLink8URL: https://datasheet.octopart.com:443/RC0603FR-071M8L-Yageo-datasheet-27584510.pdf?src-supplier=Future+Electronics; ComponentLink8Description: https://datasheet.octopart.com:443/RC0603FR-071M8L-Yageo-datasheet-27584510.pdf?src-supplier=Future+Electronics; ComponentLink9URL: https://datasheet.octopart.com:443/RC0603FR-071M8L-Yageo-datasheet-15599030.pdf?src-supplier=Future+Electronics; ComponentLink9Description: https://datasheet.octopart.com:443/RC0603FR-071M8L-Yageo-datasheet-15599030.pdf?src-supplier=Future+Electronics; ComponentLink10URL: https://datasheet.octopart.com:443/RC0603FR-071M8L-Yageo-datasheet-12596169.pdf?src-supplier=Future+Electronics; ComponentLink10Description: https://datasheet.octopart.com:443/RC0603FR-071M8L-Yageo-datasheet-12596169.pdf?src-supplier=Future+Electronics; ComponentLink11URL: https://datasheet.octopart.com:443/RC0603FR-071M8L-Yageo-datasheet-148775077.pdf?src-supplier=TME; ComponentLink11Description: https://datasheet.octopart.com:443/RC0603FR-071M8L-Yageo-datasheet-148775077.pdf?src-supplier=TME; ComponentLink12URL: https://datasheet.octopart.com/RC0603FR-071M8L-Yageo-datasheet-73766026.pdf; ComponentLink12Description: https://datasheet.octopart.com/RC0603FR-071M8L-Yageo-datasheet-73766026.pdf; ComponentLink13URL: http://sigma.octopart.com:80/rohs_statement/Yageo-company-2.pdf?src-supplier=Compliance+Statements; ComponentLink13Description: http://sigma.octopart.com:80/rohs_statement/Yageo-company-2.pdf?src-supplier=Compliance+Statements; ComponentLink14URL: http://sigma.octopart.com:80/conflict_mineral_statement/Yageo-company-3.pdf?src-supplier=Compliance+Statements; ComponentLink14Description: http://sigma.octopart.com:80/conflict_mineral_statement/Yageo-company-3.pdf?src-supplier=Compliance+Statements; Supplier 1: DigiKey; Supplier Part Number 1: YAG3328CT-ND
R10 = RESISTOR - GENERIC: Chip Resistor Automotive Grade Thick Film 0603 1MOhm 1% Paper T/R; Manufacturer: Yageo Group; Manufacturer Part Number: AC0603FR-7W1ML; Power Dissipation: 200mW; Temperature Coefficient: 100ppm/°C; Voltage Rating: 75V; Supplier: DigiKey; Supplier Part Number: 13-AC0603FR-7W1MLCT-ND; RoHS: Compliant; Category: Chip SMD Resistors; Stock: 95338; Pricing: 1=0,1, 10=0,016, 25=0,0132, 50=0,0102, 100=0,0092 (USD); Case/Package: 0603; China RoHS: Non-Compliant; Composition: Thick Film; Height: 450µm; Lifecycle Status: Production; Max Operating Temperature: 155°C; Min Operating Temperature: -55°C; Mounting Technology: Surface Mount; Number of Terminals: 2; Packaging: Tape & Reel; Power Rating: 200mW; REACH SVHC: Yes; Value: 1MΩ; Tolerance: 1%; Width: 800µm; Working Voltage: 75V; ComponentLink1URL: https://datasheet.octopart.com:443/AC0603FR-7W1ML-Yageo-datasheet-182189377.pdf?src-supplier=IHS; ComponentLink1Description: https://datasheet.octopart.com:443/AC0603FR-7W1ML-Yageo-datasheet-182189377.pdf?src-supplier=IHS; ComponentLink2URL: https://datasheet.octopart.com:443/AC0603FR-7W1ML-Yageo-datasheet-86786639.pdf?src-supplier=Upverter; ComponentLink2Description: https://datasheet.octopart.com:443/AC0603FR-7W1ML-Yageo-datasheet-86786639.pdf?src-supplier=Upverter; ComponentLink3URL: https://datasheet.octopart.com/AC0603FR-7W1ML-Yageo-datasheet-12512238.pdf; ComponentLink3Description: https://datasheet.octopart.com/AC0603FR-7W1ML-Yageo-datasheet-12512238.pdf; ComponentLink4URL: http://sigma.octopart.com:80/rohs_statement/Yageo-company-2.pdf?src-supplier=Compliance+Statements; ComponentLink4Description: http://sigma.octopart.com:80/rohs_statement/Yageo-company-2.pdf?src-supplier=Compliance+Statements; ComponentLink5URL: http://sigma.octopart.com:80/conflict_mineral_statement/Yageo-company-3.pdf?src-supplier=Compliance+Statements; ComponentLink5Description: http://sigma.octopart.com:80/conflict_mineral_statement/Yageo-company-3.pdf?src-supplier=Compliance+Statements; Supplier 1: DigiKey; Supplier Part Number 1: 13-AC0603FR-7W1MLCT-ND
R12 = RESISTOR - GENERIC: Res Thick Film 0603 200K Ohm 1% 0.1W(1/10W) ±100ppm/C Pad SMD T/R; Manufacturer: Yageo Group; Manufacturer Part Number: RC0603FR-07200KL; Max Power Dissipation: 100mW; Temperature Coefficient: 100ppm/°C; Voltage Rating: 75V; Voltage Rating (DC): 50V; Supplier: DigiKey; Supplier Part Number: 311-200KHRCT-ND; RoHS: Compliant; Category: Chip SMD Resistors; Stock: 343076; Pricing: 1=0,1, 10=0,008, 25=0,0076, 50=0,0072, 100=0,0051 (USD); Case/Package: 0603; Case Code (Imperial): 0603; China RoHS: Non-Compliant; Composition: Thick Film; Depth: 800µm; Features: Moisture Resistant; Height: 450µm; Lead Free: Lead Free; Length: 1.6mm; Lifecycle Status: Production; Max Operating Temperature: 155°C; Military Standard: Not; Min Operating Temperature: -55°C; Mounting Technology: Surface Mount; Pins: 2; Number of Terminals: 2; Number of Terminations: 2; Packaging: Tape & Reel; Power Dissipation: 100mW; Power Rating: 100mW; REACH SVHC: Yes; Value: 200kΩ; Schedule B: 8533210045, 8533210045|8533210045, 8533210045|8533210045|8533210045, 8533210045|8533210045|8533210045|8533210045; Termination: SMD/SMT; Tolerance: 1%; Width: 800µm; Working Voltage: 75V; ComponentLink1URL: https://datasheet.octopart.com:443/RC0603FR-07200KL-Yageo-datasheet-175887523.pdf?src-supplier=IHS; ComponentLink1Description: https://datasheet.octopart.com:443/RC0603FR-07200KL-Yageo-datasheet-175887523.pdf?src-supplier=IHS; ComponentLink2URL: https://datasheet.octopart.com:443/RC0603FR-07200KL-Yageo-datasheet-141265859.pdf?src-supplier=Upverter; ComponentLink2Description: https://datasheet.octopart.com:443/RC0603FR-07200KL-Yageo-datasheet-141265859.pdf?src-supplier=Upverter; ComponentLink3URL: https://datasheet.octopart.com:443/RC0603FR-07200KL-Yageo-datasheet-103092701.pdf?src-supplier=Upverter; ComponentLink3Description: https://datasheet.octopart.com:443/RC0603FR-07200KL-Yageo-datasheet-103092701.pdf?src-supplier=Upverter; ComponentLink4URL: https://sigma.octopart.com:443/138820526/technical_drawing/Yageo-RC0603FR-07200KL.pdf?src-supplier=Upverter; ComponentLink4Description: https://sigma.octopart.com:443/138820526/technical_drawing/Yageo-RC0603FR-07200KL.pdf?src-supplier=Upverter; ComponentLink5URL: https://datasheet.octopart.com:443/RC0603FR-07200KL-Yageo-datasheet-8328172.pdf?src-supplier=Burklin+Elektronik; ComponentLink5Description: https://datasheet.octopart.com:443/RC0603FR-07200KL-Yageo-datasheet-8328172.pdf?src-supplier=Burklin+Elektronik; ComponentLink6URL: https://datasheet.octopart.com:443/RC0603FR-07200KL-Yageo-datasheet-62067350.pdf?src-supplier=Farnell; ComponentLink6Description: https://datasheet.octopart.com:443/RC0603FR-07200KL-Yageo-datasheet-62067350.pdf?src-supplier=Farnell; ComponentLink7URL: https://datasheet.octopart.com:443/RC0603FR-07200KL-Yageo-datasheet-34211833.pdf?src-supplier=element14+APAC; ComponentLink7Description: https://datasheet.octopart.com:443/RC0603FR-07200KL-Yageo-datasheet-34211833.pdf?src-supplier=element14+APAC; ComponentLink8URL: https://datasheet.octopart.com:443/RC0603FR-07200KL-Yageo-datasheet-164759695.pdf?src-supplier=Future+Electronics; ComponentLink8Description: https://datasheet.octopart.com:443/RC0603FR-07200KL-Yageo-datasheet-164759695.pdf?src-supplier=Future+Electronics; ComponentLink9URL: https://datasheet.octopart.com:443/RC0603FR-07200KL-Yageo-datasheet-137700087.pdf?src-supplier=Future+Electronics; ComponentLink9Description: https://datasheet.octopart.com:443/RC0603FR-07200KL-Yageo-datasheet-137700087.pdf?src-supplier=Future+Electronics; ComponentLink10URL: https://datasheet.octopart.com:443/RC0603FR-07200KL-Yageo-datasheet-15599030.pdf?src-supplier=Future+Electronics; ComponentLink10Description: https://datasheet.octopart.com:443/RC0603FR-07200KL-Yageo-datasheet-15599030.pdf?src-supplier=Future+Electronics; ComponentLink11URL: https://datasheet.octopart.com:443/RC0603FR-07200KL-Yageo-datasheet-12596169.pdf?src-supplier=Future+Electronics; ComponentLink11Description: https://datasheet.octopart.com:443/RC0603FR-07200KL-Yageo-datasheet-12596169.pdf?src-supplier=Future+Electronics; ComponentLink12URL: https://datasheet.octopart.com:443/RC0603FR-07200KL-Yageo-datasheet-8324193.pdf?src-supplier=Future+Electronics; ComponentLink12Description: https://datasheet.octopart.com:443/RC0603FR-07200KL-Yageo-datasheet-8324193.pdf?src-supplier=Future+Electronics; ComponentLink13URL: https://datasheet.octopart.com:443/RC0603FR-07200KL-Yageo-datasheet-148775077.pdf?src-supplier=TME; ComponentLink13Description: https://datasheet.octopart.com:443/RC0603FR-07200KL-Yageo-datasheet-148775077.pdf?src-supplier=TME; ComponentLink14URL: https://datasheet.octopart.com:443/RC0603FR-07200KL-Yageo-datasheet-79472498.pdf?src-supplier=Megastar; ComponentLink14Description: https://datasheet.octopart.com:443/RC0603FR-07200KL-Yageo-datasheet-79472498.pdf?src-supplier=Megastar; ComponentLink15URL: https://datasheet.octopart.com/RC0603FR-07200KL-Yageo-datasheet-73766026.pdf; ComponentLink15Description: https://datasheet.octopart.com/RC0603FR-07200KL-Yageo-datasheet-73766026.pdf; ComponentLink16URL: https://datasheet.octopart.com:443/RC0603FR-07200KL-Yageo-datasheet-118562.pdf?src-supplier=DigiKey; ComponentLink16Description: https://datasheet.octopart.com:443/RC0603FR-07200KL-Yageo-datasheet-118562.pdf?src-supplier=DigiKey; ComponentLink17URL: http://sigma.octopart.com:80/rohs_statement/Yageo-company-2.pdf?src-supplier=Compliance+Statements; ComponentLink17Description: http://sigma.octopart.com:80/rohs_statement/Yageo-company-2.pdf?src-supplier=Compliance+Statements; ComponentLink18URL: http://sigma.octopart.com:80/conflict_mineral_statement/Yageo-company-3.pdf?src-supplier=Compliance+Statements; ComponentLink18Description: http://sigma.octopart.com:80/conflict_mineral_statement/Yageo-company-3.pdf?src-supplier=Compliance+Statements; Supplier 1: DigiKey; Supplier Part Number 1: 311-200KHRCT-ND
R13 = RESISTOR - GENERIC: Res Thick Film 0603 2.1M Ohm 1% 1/10W ±100ppm/°C Molded SMD SMD Paper T/R; Manufacturer: Yageo Group; Manufacturer Part Number: RC0603FR-072M1L; Max Power Dissipation: 100mW; Voltage Rating: 75V; Supplier: DigiKey; Supplier Part Number: 13-RC0603FR-072M1LCT-ND; RoHS: Compliant; Category: Chip SMD Resistors; Stock: 19743; Pricing: 1=0,1, 10=0,007, 25=0,0052 (USD); Case/Package: 0603; Case Code (Imperial): 0603; Case Code (Metric): 1608; China RoHS: Non-Compliant; Composition: Thick Film; Contact Plating: Tin; Features: Moisture Resistant; Height: 450µm; Length: 1.6002mm; Lifecycle Status: Production; Max Operating Temperature: 155°C; Min Operating Temperature: -55°C; Mounting Technology: Surface Mount; Number of Terminals: 2; Number of Terminations: 2; Packaging: Tape & Reel; Power Dissipation: 100mW; Power Rating: 100mW; Radiation Hardening: No; REACH SVHC: Yes; Value: 2.1MΩ; Schedule B: 8533210045, 8533210045|8533210045|8533210045|8533210045|8533210045; Temperature Coefficient: 100ppm/°C; Termination: SMD/SMT; Tolerance: 1%; Width: 800µm; Working Voltage: 75V; ComponentLink1URL: https://datasheet.octopart.com:443/RC0603FR-072M1L-Yageo-datasheet-175887523.pdf?src-supplier=IHS; ComponentLink1Description: https://datasheet.octopart.com:443/RC0603FR-072M1L-Yageo-datasheet-175887523.pdf?src-supplier=IHS; ComponentLink2URL: https://datasheet.octopart.com:443/RC0603FR-072M1L-Yageo-datasheet-103092701.pdf?src-supplier=Upverter; ComponentLink2Description: https://datasheet.octopart.com:443/RC0603FR-072M1L-Yageo-datasheet-103092701.pdf?src-supplier=Upverter; ComponentLink3URL: https://datasheet.octopart.com/RC0603FR-072M1L-Yageo-datasheet-73766026.pdf; ComponentLink3Description: https://datasheet.octopart.com/RC0603FR-072M1L-Yageo-datasheet-73766026.pdf; ComponentLink4URL: https://datasheet.octopart.com:443/RC0603FR-072M1L-Yageo-datasheet-8328172.pdf?src-supplier=_legacy+Avnet; ComponentLink4Description: https://datasheet.octopart.com:443/RC0603FR-072M1L-Yageo-datasheet-8328172.pdf?src-supplier=_legacy+Avnet; ComponentLink5URL: http://sigma.octopart.com:80/rohs_statement/Yageo-company-2.pdf?src-supplier=Compliance+Statements; ComponentLink5Description: http://sigma.octopart.com:80/rohs_statement/Yageo-company-2.pdf?src-supplier=Compliance+Statements; ComponentLink6URL: http://sigma.octopart.com:80/conflict_mineral_statement/Yageo-company-3.pdf?src-supplier=Compliance+Statements; ComponentLink6Description: http://sigma.octopart.com:80/conflict_mineral_statement/Yageo-company-3.pdf?src-supplier=Compliance+Statements; Supplier 1: DigiKey; Supplier Part Number 1: 13-RC0603FR-072M1LCT-ND